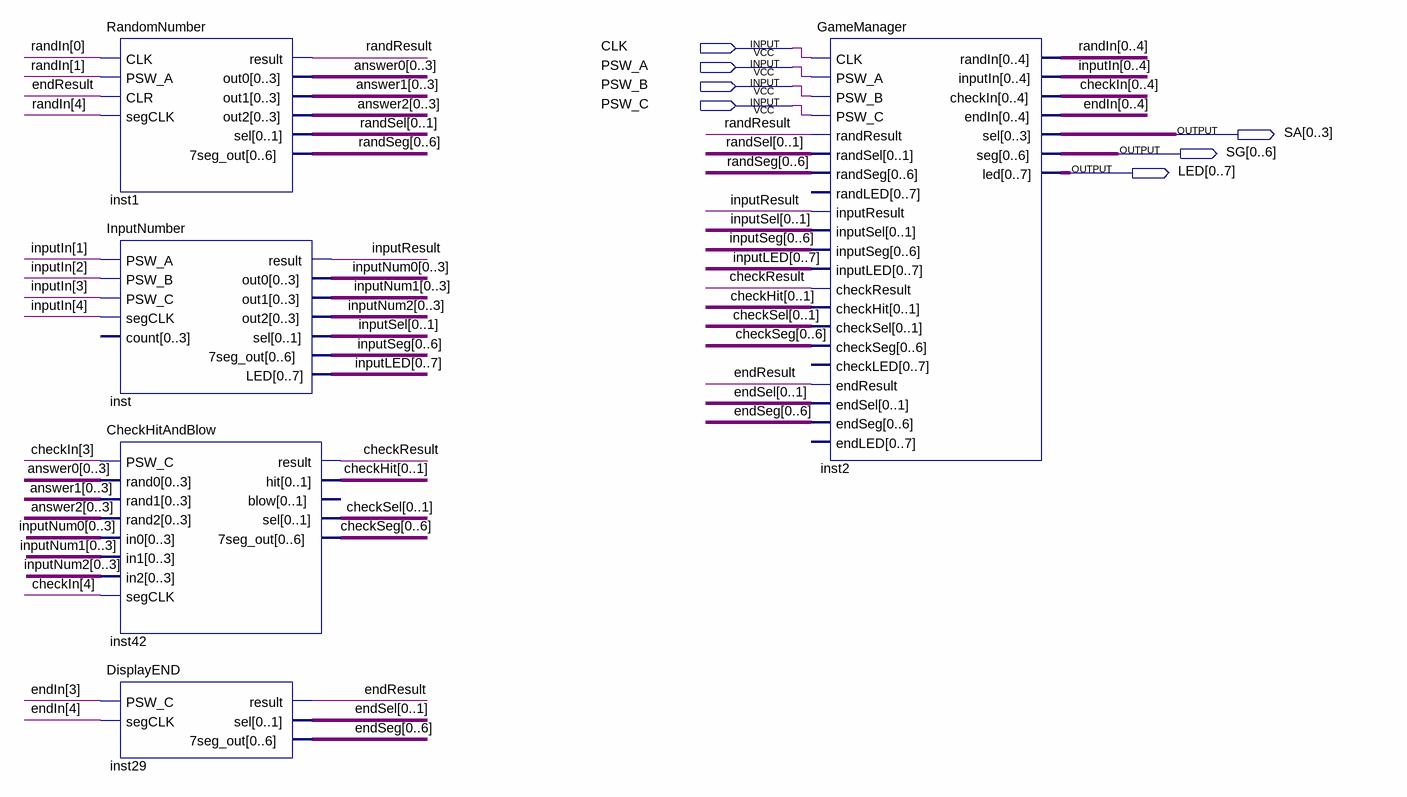
[diagram p0: schematic sheet]
// Quartus schematic HitAndBlow.bdf as structural Verilog: 5 symbols, 7 pins
module HitAndBlow (
  input  CLK,
  input  PSW_A,
  input  PSW_B,
  input  PSW_C,
  output [0:3] SA,
  output [0:6] SG,
  output [0:7] LED
);

  wire checkResult, endResult, inputResult, randResult;
  wire [1:0] checkHit, checkSel, endSel, inputSel, randSel;
  wire [3:0] answer0, answer1, answer2, inputNum0, inputNum1, inputNum2;
  wire [4:0] checkIn, endIn, inputIn, randIn;
  wire [6:0] checkSeg, endSeg, inputSeg, randSeg;
  wire [7:0] inputLED;

  RandomNumber inst1 (
    .CLK(randIn[0]), .PSW_A(randIn[1]), .CLR(endResult), .segCLK(randIn[4]), .result(randResult),
    .out0({answer0[0], answer0[1], answer0[2], answer0[3]}),
    .out1({answer1[0], answer1[1], answer1[2], answer1[3]}),
    .out2({answer2[0], answer2[1], answer2[2], answer2[3]}), .sel({randSel[0], randSel[1]}),
    .\7seg_out ({randSeg[0], randSeg[1], randSeg[2], randSeg[3], randSeg[4], randSeg[5], randSeg[6]}));
  InputNumber inst (
    .PSW_A(inputIn[1]), .PSW_B(inputIn[2]), .PSW_C(inputIn[3]), .segCLK(inputIn[4]), .result(inputResult),
    .out0({inputNum0[0], inputNum0[1], inputNum0[2], inputNum0[3]}),
    .out1({inputNum1[0], inputNum1[1], inputNum1[2], inputNum1[3]}),
    .out2({inputNum2[0], inputNum2[1], inputNum2[2], inputNum2[3]}), .sel({inputSel[0], inputSel[1]}),
    .\7seg_out ({inputSeg[0], inputSeg[1], inputSeg[2], inputSeg[3], inputSeg[4], inputSeg[5], inputSeg[6]}),
    .LED({inputLED[0], inputLED[1], inputLED[2], inputLED[3], inputLED[4], inputLED[5], inputLED[6], inputLED[7]}));  // open: count
  CheckHitAndBlow inst42 (
    .PSW_C(checkIn[3]), .rand0({answer0[0], answer0[1], answer0[2], answer0[3]}),
    .rand1({answer1[0], answer1[1], answer1[2], answer1[3]}),
    .rand2({answer2[0], answer2[1], answer2[2], answer2[3]}),
    .in0({inputNum0[0], inputNum0[1], inputNum0[2], inputNum0[3]}),
    .in1({inputNum1[0], inputNum1[1], inputNum1[2], inputNum1[3]}),
    .in2({inputNum2[0], inputNum2[1], inputNum2[2], inputNum2[3]}), .segCLK(checkIn[4]),
    .result(checkResult), .hit({checkHit[0], checkHit[1]}), .sel({checkSel[0], checkSel[1]}),
    .\7seg_out ({checkSeg[0], checkSeg[1], checkSeg[2], checkSeg[3], checkSeg[4], checkSeg[5], checkSeg[6]}));  // open: blow
  DisplayEND inst29 (
    .PSW_C(endIn[3]), .segCLK(endIn[4]), .result(endResult), .sel({endSel[0], endSel[1]}),
    .\7seg_out ({endSeg[0], endSeg[1], endSeg[2], endSeg[3], endSeg[4], endSeg[5], endSeg[6]}));
  GameManager inst2 (
    .CLK(CLK), .PSW_A(PSW_A), .PSW_B(PSW_B), .PSW_C(PSW_C), .randResult(randResult),
    .randSel({randSel[0], randSel[1]}),
    .randSeg({randSeg[0], randSeg[1], randSeg[2], randSeg[3], randSeg[4], randSeg[5], randSeg[6]}),
    .inputResult(inputResult), .inputSel({inputSel[0], inputSel[1]}),
    .inputSeg({inputSeg[0], inputSeg[1], inputSeg[2], inputSeg[3], inputSeg[4], inputSeg[5], inputSeg[6]}),
    .inputLED({inputLED[0], inputLED[1], inputLED[2], inputLED[3], inputLED[4], inputLED[5], inputLED[6], inputLED[7]}),
    .checkResult(checkResult), .checkHit({checkHit[0], checkHit[1]}), .checkSel({checkSel[0], checkSel[1]}),
    .checkSeg({checkSeg[0], checkSeg[1], checkSeg[2], checkSeg[3], checkSeg[4], checkSeg[5], checkSeg[6]}),
    .endResult(endResult), .endSel({endSel[0], endSel[1]}),
    .endSeg({endSeg[0], endSeg[1], endSeg[2], endSeg[3], endSeg[4], endSeg[5], endSeg[6]}),
    .randIn({randIn[0], randIn[1], randIn[2], randIn[3], randIn[4]}),
    .inputIn({inputIn[0], inputIn[1], inputIn[2], inputIn[3], inputIn[4]}),
    .checkIn({checkIn[0], checkIn[1], checkIn[2], checkIn[3], checkIn[4]}),
    .endIn({endIn[0], endIn[1], endIn[2], endIn[3], endIn[4]}), .sel(SA), .seg(SG), .led(LED));  // open: randLED, checkLED, endLED
endmodule
